# Altium schematic sheet SYS_PWR_ADC.SchDoc
size Tabloid; Organization: Altium Limited; Address1: L3, 12a Rodborough Rd; Address2: Frenchs Forest; Address3: NSW; Address4: Australia 2086
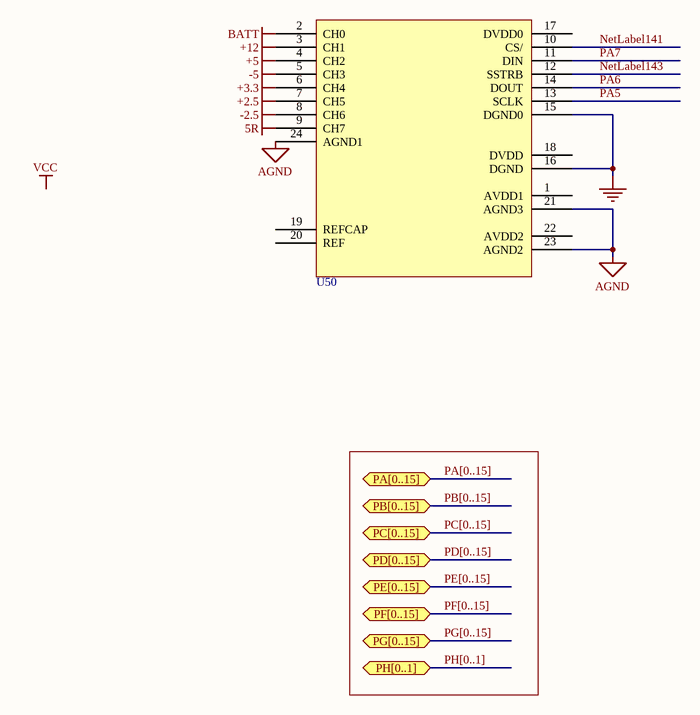
[diagram p0: SYS_PWR_ADC.SchDoc]

## Parts
U50  MAX1300  [MAX1300]  (value not drawn)

## Ports
PA[0..15] (bidir), PB[0..15] (bidir), PC[0..15] (bidir), PD[0..15] (bidir), PE[0..15] (bidir), PF[0..15] (bidir), PG[0..15] (bidir), PH[0..1] (bidir)

## Nets
5R: U50.9(CH7)
+2.5: U50.7(CH5)
+3.3: U50.6(CH4)
+5: U50.4(CH2)
+12: U50.3(CH1)
-2.5: U50.8(CH6)
-5: U50.5(CH3)
AGND: U50.21(AGND3) U50.23(AGND2) U50.24(AGND1)
BATT: U50.2(CH0)
GND: U50.15(DGND0) U50.16(DGND)
NetLabel141: U50.10(CS/)
NetLabel143: U50.12(SSTRB)
PA5: U50.13(SCLK)
PA6: U50.14(DOUT)
PA7: U50.11(DIN)

Not connected (* = marked no-connect by the designer): U50 1(AVDD1) 17(DVDD0) 18(DVDD) 19(REFCAP) 20(REF) 22(AVDD2)

## Buses and harness runs
bus PA[0..15] = port PA[0..15]
bus PB[0..15] = port PB[0..15]
bus PC[0..15] = port PC[0..15]
bus PD[0..15] = port PD[0..15]
bus PE[0..15] = port PE[0..15]
bus PF[0..15] = port PF[0..15]
bus PG[0..15] = port PG[0..15]
bus PH[0..1] = port PH[0..1]

## Notes on the sheet
- Labels drawn without touching a wire or pin: VCC
- Title
- Size:
- Date:
- Tabloid
- Number:
- Time:
- Revision:
- Sheet
- of
- File: